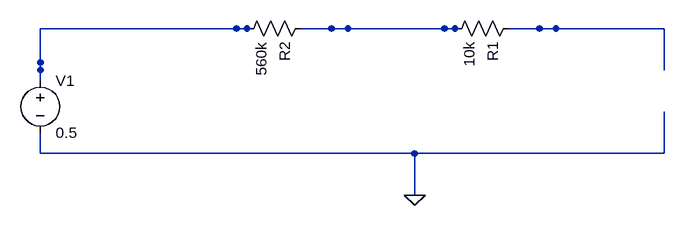
[diagram p0: schematic pannel1.asc]
pannel1.asc, the LTspice schematic file:
Version 4
SHEET 1 880 680
WIRE 912 320 985 320
WIRE 814 320 830 320
SYMBOL res 928 304 R90
SYMATTR InstName R1
SYMATTR Value 10k
WIRE 592 320 665 320
WIRE 494 320 510 320
SYMBOL res 608 304 R90
SYMATTR InstName R2
SYMATTR Value 560k
FLAG 768 576 0
WIRE 192 400 192 372
WIRE 192 512 192 480
SYMBOL voltage 192 384 R0
SYMATTR InstName V1
SYMATTR Value 0.5
WIRE 1088 512 1152 512
WIRE 1152 448 1152 512
WIRE 768 512 832 512
WIRE 704 512 768 512
WIRE 768 512 768 576
WIRE 192 512 256 512
WIRE 192 320 256 320
WIRE 192 320 192 384
WIRE 1088 320 1152 320
WIRE 1152 320 1152 384
WIRE 960 320 1024 320
WIRE 256 512 320 512
WIRE 640 512 704 512
WIRE 576 512 640 512
WIRE 512 512 576 512
WIRE 448 512 512 512
WIRE 384 512 448 512
WIRE 320 512 384 512
WIRE 896 512 960 512
WIRE 832 512 896 512
WIRE 960 512 1024 512
WIRE 1024 512 1088 512
WIRE 256 320 320 320
WIRE 320 320 384 320
WIRE 384 320 448 320
WIRE 448 320 512 320
WIRE 640 320 704 320
WIRE 704 320 768 320
WIRE 768 320 832 320
WIRE 1024 320 1088 320

The netlist it stands for:
* pannel1.asc
R1 N001 N002 10k
R2 N002 N003 560k
V1 N003 0 0.5
.backanno
.end